# Altium schematic sheet Teclado numerico.SchDoc: Teclado numérico
size Letter
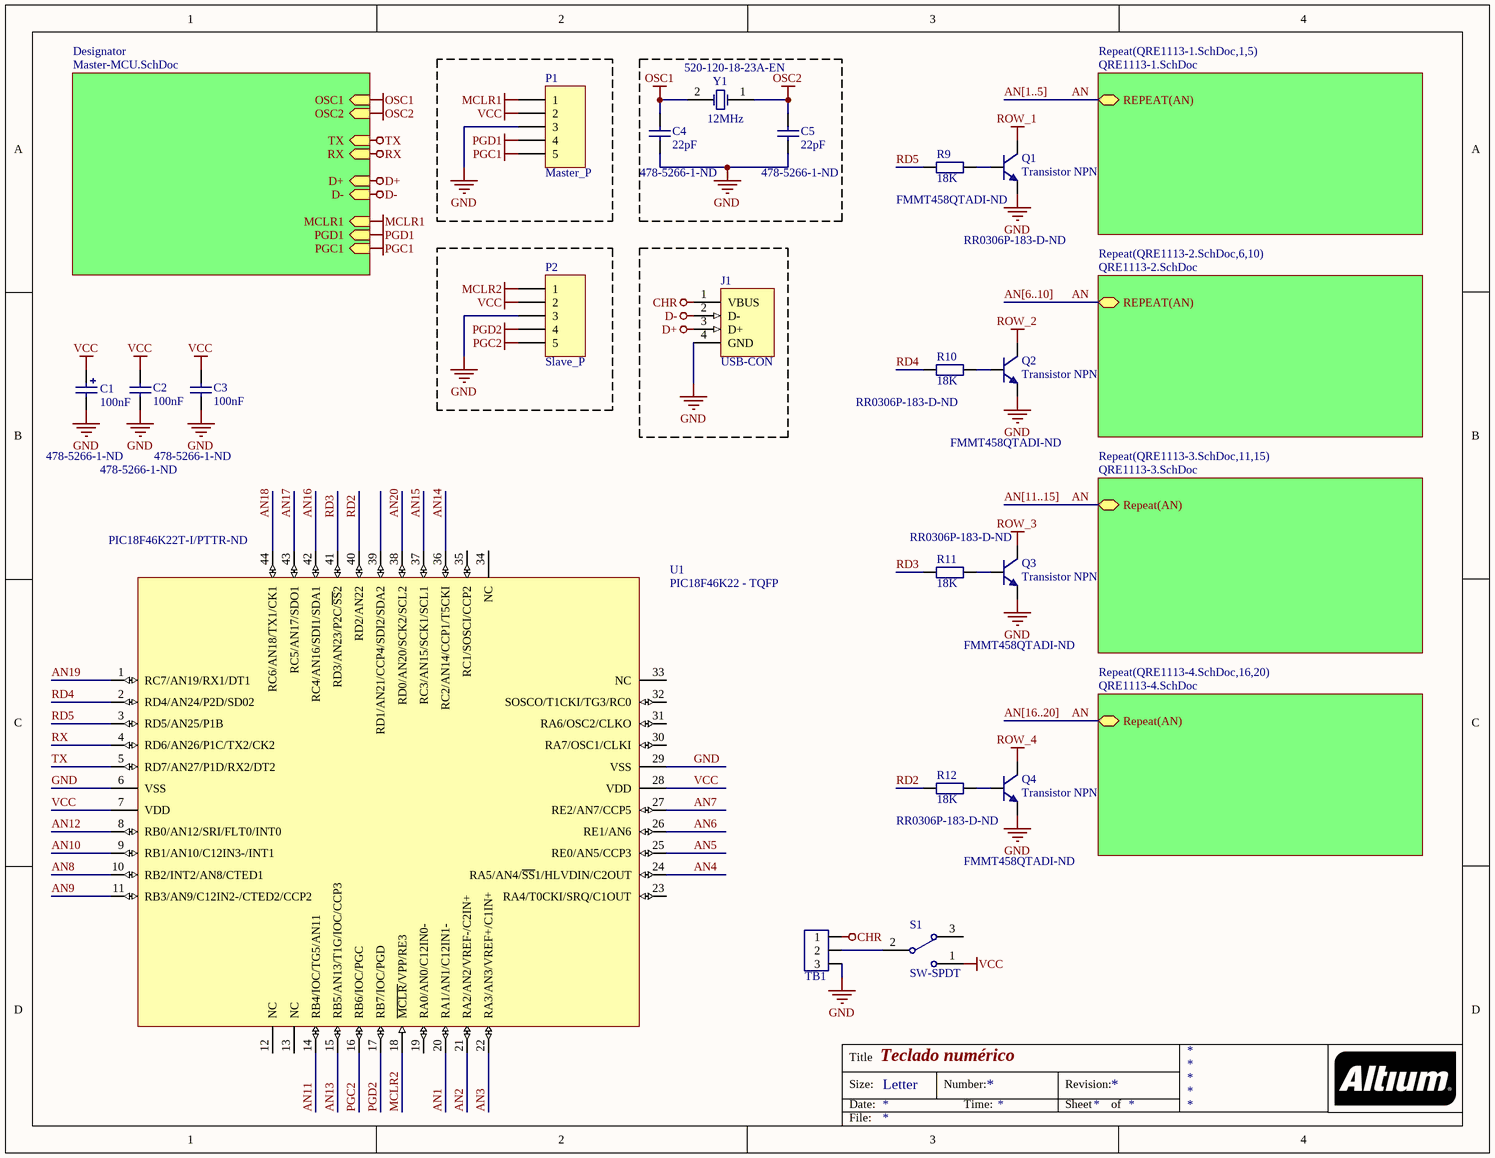
[diagram p0: Teclado numerico.SchDoc]

## Parts
C1  100nF  Supplier Part Number 1: 478-5266-1-ND  [C-0603]
C2  100nF  Supplier Part Number 1: 478-5266-1-ND  [C-0603]
C3  100nF  Supplier Part Number 1: 478-5266-1-ND  [C-0603]
C4  22pF  Supplier Part Number 1: 478-5266-1-ND  [C-0603]
C5  22pF  Supplier Part Number 1: 478-5266-1-ND  [C-0603]
J1  USB-CON  [USB-A]
P1  Master_P  [HDR1X5]
P2  Slave_P  [HDR1X5]
Q1  Transistor NPN  Supplier Part Number 1: FMMT458QTADI-ND  [SOT95P237X111-3M-JV]
Q2  Transistor NPN  Supplier Part Number 1: FMMT458QTADI-ND  [SOT95P237X111-3M-JV]
Q3  Transistor NPN  Supplier Part Number 1: FMMT458QTADI-ND  [SOT95P237X111-3M-JV]
Q4  Transistor NPN  Supplier Part Number 1: FMMT458QTADI-ND  [SOT95P237X111-3M-JV]
R9  18K  Supplier Part Number 1: RR0306P-183-D-ND  [R-0603]
R10  18K  Supplier Part Number 1: RR0306P-183-D-ND  [R-0603]
R11  18K  Supplier Part Number 1: RR0306P-183-D-ND  [R-0603]
R12  18K  Supplier Part Number 1: RR0306P-183-D-ND  [R-0603]
S1  SW-SPDT  [SPDT]
TB1  Terminal Block 3  [SPDT]  (value not drawn)
U1  PIC18F46K22 - TQFP  Supplier Part Number 3: PIC18F46K22T-I/PTTR-ND  [TQFP-44_JV]
Y1  12MHz  Supplier Part Number 1: 520-120-18-23A-EN  [ECX64A-jv]

## Sub-sheets
Designator = Master-MCU.SchDoc: OSC1 (in), OSC2 (in), TX (in), RX (in), D+ (in), D- (in), MCLR1 (in), PGD1 (in), PGC1 (in)
Repeat(QRE1113-1.SchDoc,1,5) = QRE1113-1.SchDoc: REPEAT(AN)
Repeat(QRE1113-2.SchDoc,6,10) = QRE1113-2.SchDoc: REPEAT(AN)
Repeat(QRE1113-3.SchDoc,11,15) = QRE1113-3.SchDoc: Repeat(AN)
Repeat(QRE1113-4.SchDoc,16,20) = QRE1113-4.SchDoc: Repeat(AN)

## Nets
CHR: J1.1(VBUS) TB1.1
D+: J1.3(D+) ; sheet Designator/D+
D-: J1.2(D-) ; sheet Designator/D-
GND: C1.2 C2.1 C3.1 C4.2 C5.2 J1.4(GND) P1.3 P2.3 Q1.1(E) Q2.1(E) Q3.1(E) Q4.1(E) TB1.3 U1.6(VSS) U1.29(VSS)
MCLR1: P1.1 ; sheet Designator/MCLR1
MCLR2: P2.1 U1.18(~{MCLR}/VPP/RE3)
OSC1: C4.1 Y1.2(OSC2) ; sheet Designator/OSC1
OSC2: C5.1 Y1.1(OSC1) ; sheet Designator/OSC2
PGC1: P1.5 ; sheet Designator/PGC1
PGC2: P2.5 U1.16(RB6/IOC/PGC)
PGD1: P1.4 ; sheet Designator/PGD1
PGD2: P2.4 U1.17(RB7/IOC/PGD)
ROW_1: Q1.3(C)
ROW_2: Q2.3(C)
ROW_3: Q3.3(C)
ROW_4: Q4.3(C)
RX: U1.4(RD6/AN26/P1C/TX2/CK2) ; sheet Designator/RX
TX: U1.5(RD7/AN27/P1D/RX2/DT2) ; sheet Designator/TX
VCC: C1.1 C2.2 C3.2 P1.2 P2.2 S1.1 U1.7(VDD) U1.28(VDD)
AN: sheet Repeat(QRE1113-1.SchDoc,1,5)/REPEAT(AN), sheet Repeat(QRE1113-2.SchDoc,6,10)/REPEAT(AN), sheet Repeat(QRE1113-3.SchDoc,11,15)/Repeat(AN), sheet Repeat(QRE1113-4.SchDoc,16,20)/Repeat(AN)
AN1: U1.20(RA1/AN1/C12IN1-)
AN2: U1.21(RA2/AN2/VREF-/C2IN+)
AN3: U1.22(RA3/AN3/VREF+/C1IN+)
AN4: U1.24(RA5/AN4/~{SS}1/HLVDIN/C2OUT)
AN5: U1.25(RE0/AN5/CCP3)
AN6: U1.26(RE1/AN6)
AN7: U1.27(RE2/AN7/CCP5)
AN8: U1.10(RB2/INT2/AN8/CTED1)
AN9: U1.11(RB3/AN9/C12IN2-/CTED2/CCP2)
AN10: U1.9(RB1/AN10/C12IN3-/INT1)
AN11: U1.14(RB4/IOC/TG5/AN11)
AN12: U1.8(RB0/AN12/SRI/FLT0/INT0)
AN13: U1.15(RB5/AN13/T1G/IOC/CCP3)
AN14: U1.36(RC2/AN14/CCP1/T5CKI)
AN15: U1.37(RC3/AN15/SCK1/SCL1)
AN16: U1.42(RC4/AN16/SDI1/SDA1)
AN17: U1.43(RC5/AN17/SDO1)
AN18: U1.44(RC6/AN18/TX1/CK1)
AN19: U1.1(RC7/AN19/RX1/DT1)
AN20: U1.38(RD0/AN20/SCK2/SCL2)
RD2: R12.1 U1.40(RD2/AN22)
RD3: R11.1 U1.41(RD3/AN23/P2C/~{SS}2)
RD4: R10.1 U1.2(RD4/AN24/P2D/SD02)
RD5: R9.1 U1.3(RD5/AN25/P1B)
NetQ1_2: Q1.2(B) R9.2
NetQ2_2: Q2.2(B) R10.2
NetQ3_2: Q3.2(B) R11.2
NetQ4_2: Q4.2(B) R12.2
NetS1_2: S1.2 TB1.2

Not connected (* = marked no-connect by the designer): S1 3; U1 12(NC) 13(NC) 19(RA0/AN0/C12IN0-) 23(RA4/T0CKI/SRQ/C1OUT) 30(RA7/OSC1/CLKI) 31(RA6/OSC2/CLKO) 32(SOSCO/T1CKI/TG3/RC0) 33(NC) 34(NC) 35(RC1/SOSCI/CCP2) 39(RD1/AN21/CCP4/SDI2/SDA2)

## Buses and harness runs
bus AN[1..5]
bus AN[6..10]
bus AN[11..15]
bus AN[16..20]

## Notes on the sheet
- Title
- Size:
- Date:
- Letter
- Number:
- Time:
- Revision:
- Sheet
- of
- File:

## Library data of the parts
C1 = Electrolytic Capacitor: Value: 100uF; Supplier 1: Digi-Key
C2-C5 = Capacitor 1: Capacitor; Value: 100pF; Supplier 1: Digi-Key
J1 = USB-CON: USB 1.1, Right Angle, SMT, A Type, Receptacle, 4 Position, White; ContactMaterial: Copper Alloy; ContactPlating: Gold over Palladium Nickel; PCB_Layout: Complies with manufacturer's recommendation.; DrillSize: Corresponds to nominal value.; PanelGround: Without; Published: 15-Jul-2004; DatasheetDocument: 11-Apr-2003; PackageDocument: 11-Apr-2003; PackageReference: 353576; Publisher: Altium Limited; HousingMaterial: Thermoplastic; ComponentLink1Description: Manufacturer Link; ComponentLink1URL: http://www.tycoelectronics.com/; ComponentLink2Description: Packaging Specification; ComponentLink2URL: http://ecommas.tycoelectronics.com/commerce/DocumentDelivery/DDEController?Action=showdoc&DocId=Customer+Drawing%7F353576%7FD%7Ftif%7FJapanese%7FJPN_CD_353576_D.tif
P1 P2 = Header 5: Header, 5-Pin; LatestRevisionDate: 17-Jul-2002; LatestRevisionNote: Re-released for DXP Platform.; Publisher: Altium Limited
Q1-Q4 = Transistor NPN: NPN General Purpose Amplifier; Published: 8-Jun-2000; LatestRevisionDate: 15-Jan-2003; LatestRevisionNote: PCB Footprint 'BCY-W3/D4.7' replaced; DatasheetVersion: 1997; PackageVersion: Sep-1998; PackageReference: TO-92A; Publisher: Altium Limited; Code_JEDEC: TO-92A; ComponentLink1Description: Manufacturer Link; ComponentLink1URL: http://www.fairchildsemi.com/; ComponentLink2Description: Datasheet; ComponentLink2URL: http://www.fairchildsemi.com/ds/2N%2F2N3904.pdf; Supplier 1: Digi-Key
R9-R12 = Resistor 1: Resistor; Value: 1K; Supplier 1: Digi-Key
S1 = SW-SPDT: SPDT Subminiature Toggle Switch, Right Angle Mounting, Vertical Actuation; Published: 24-Mar-1999; LatestRevisionDate: 17-Dec-2003; LatestRevisionNote: Schematic revised, PCB Footprint replaced.; DatasheetVersion: 05-Dec-2000; PackageReference: TL36WW15050; Publisher: Altium Limited; ComponentLink1Description: Manufacturer Link; ComponentLink1URL: http://www.apem.com
TB1 = Terminal Block 3: Terminal Block, 3 pins
U1 = PIC18F46K22 - TQFP: Flash Microcontroller with 10-Bit A/D and nanoWatt Technology, 32K Flash, 44-Pin QFN, Extended Temperature Range; Published: 2-Dec-2009; DatasheetVersion: revF, Sep-2009; PackageVersion: revBB, Aug-2009; PackageReference: QFN-ML44; Publisher: Altium Limited; PackageDescription: 44-Lead Plastic Quad Flat, No Lead Package (ML) - 8x8 mm Body [QFN]; Supplier 1: Digi-Key; Supplier Part Number 1: PIC18F46K20-E/ML-ND; Supplier 2: Farnell; Supplier Part Number 2: 1664863; Code_JEDEC: MO-220; Code_IPC: QFN65P800X800-44V2; ComponentLink1Description: Datasheet; ComponentLink1URL: http://ww1.microchip.com/downloads/en/DeviceDoc/41303F.pdf; ComponentLink2Description: Packaging Specification; ComponentLink2URL: http://www.microchip.com/stellent/groups/techpub_sg/documents/packagingspec/en012702.pdf; ComponentLink3Description: Microchip.com Home; ComponentLink3URL: http://www.microchip.com/; Supplier 3: Digi-Key
Y1 = XTAL: Crystal Oscillator; Published: 8-Jun-2000; LatestRevisionDate: 17-Jul-2002; LatestRevisionNote: Re-released for DXP Platform.; PackageReference: R38; Publisher: Altium Limited; Supplier 1: Mouser